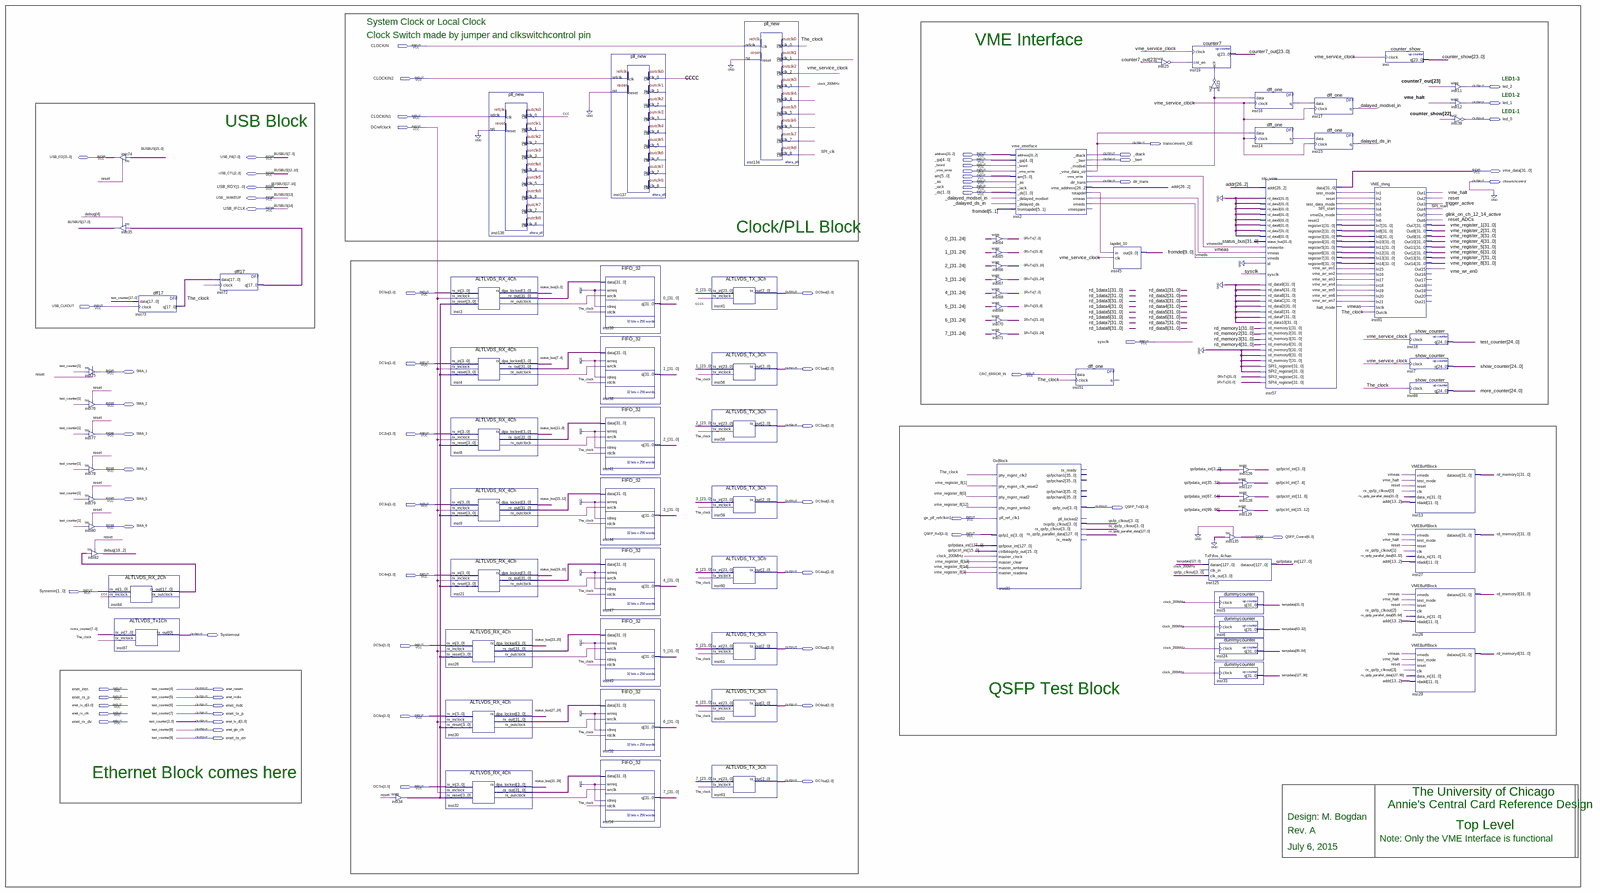
[diagram p0: schematic sheet, whole]
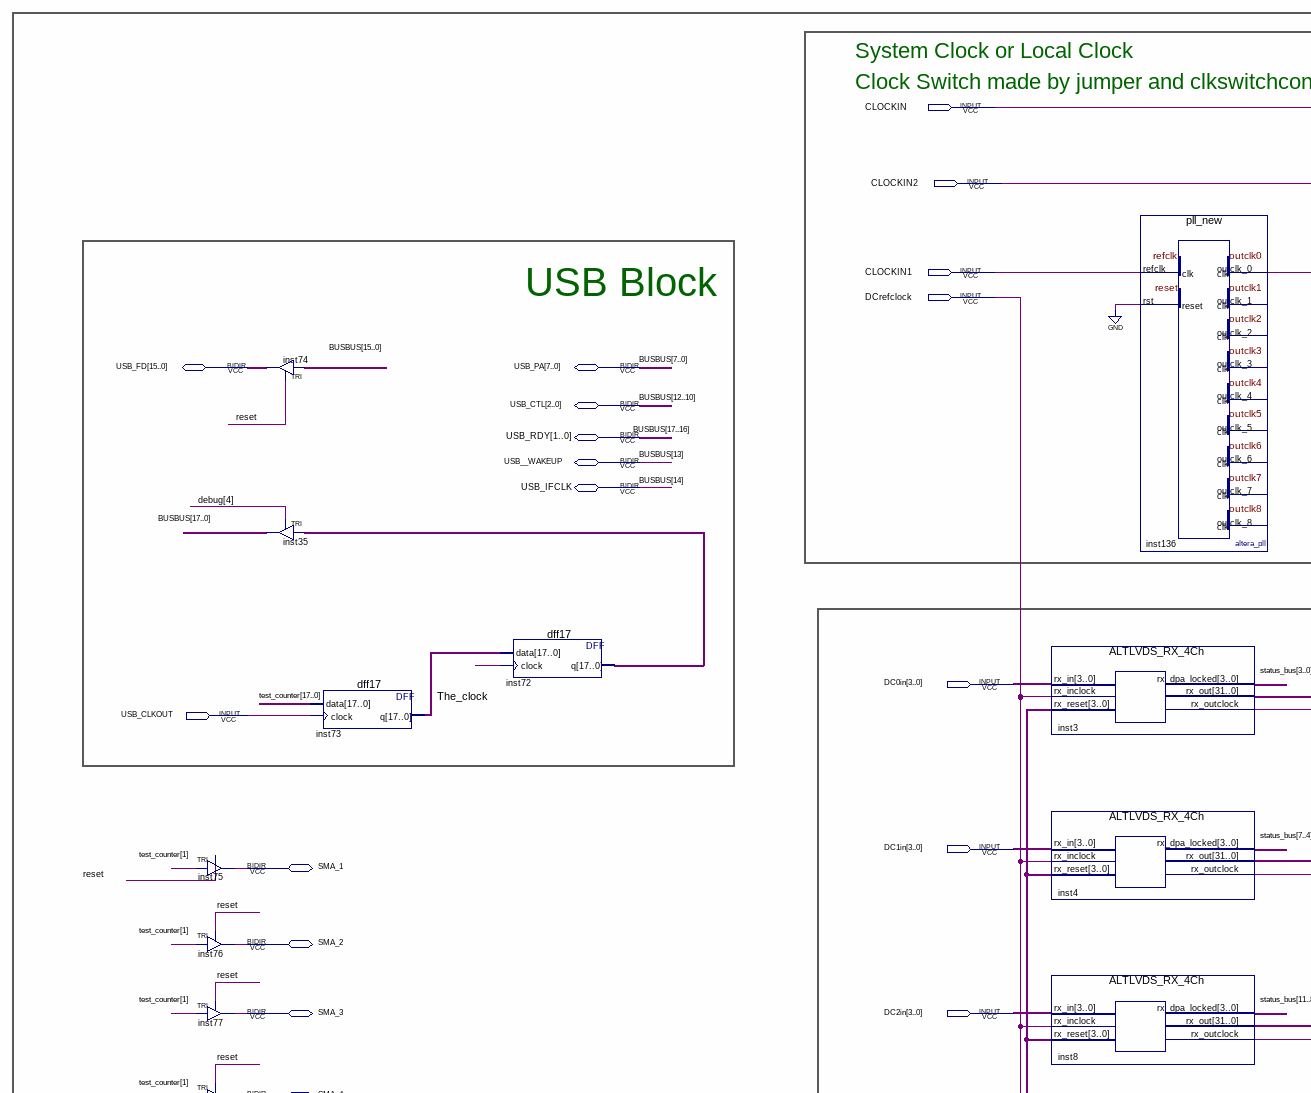
[diagram p1: schematic sheet, upper left part]
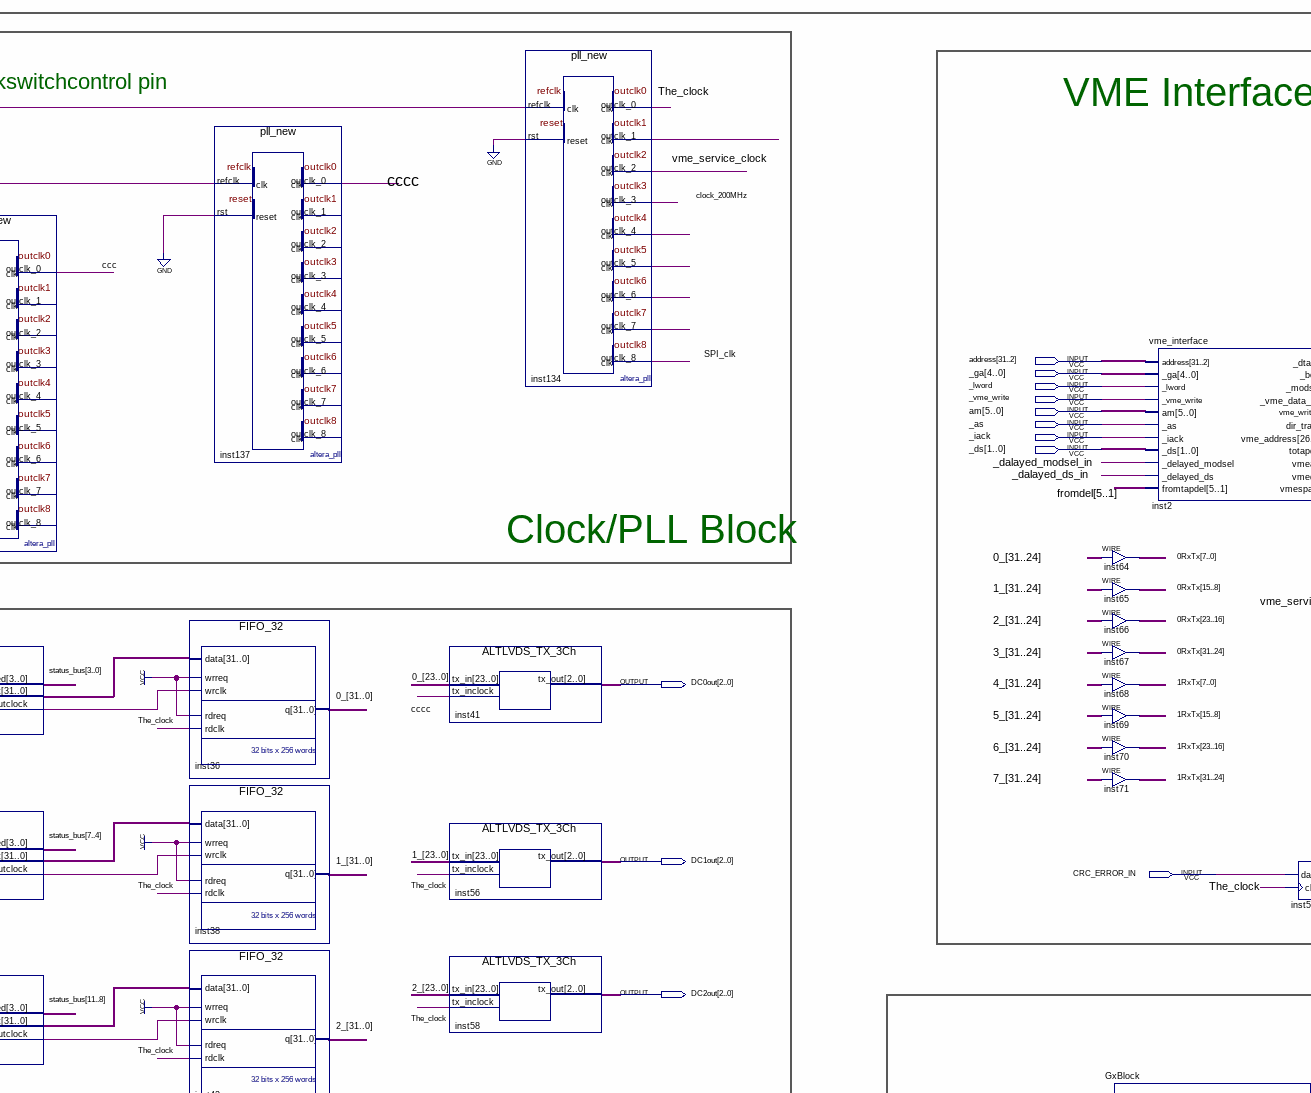
[diagram p2: schematic sheet, upper centre part]
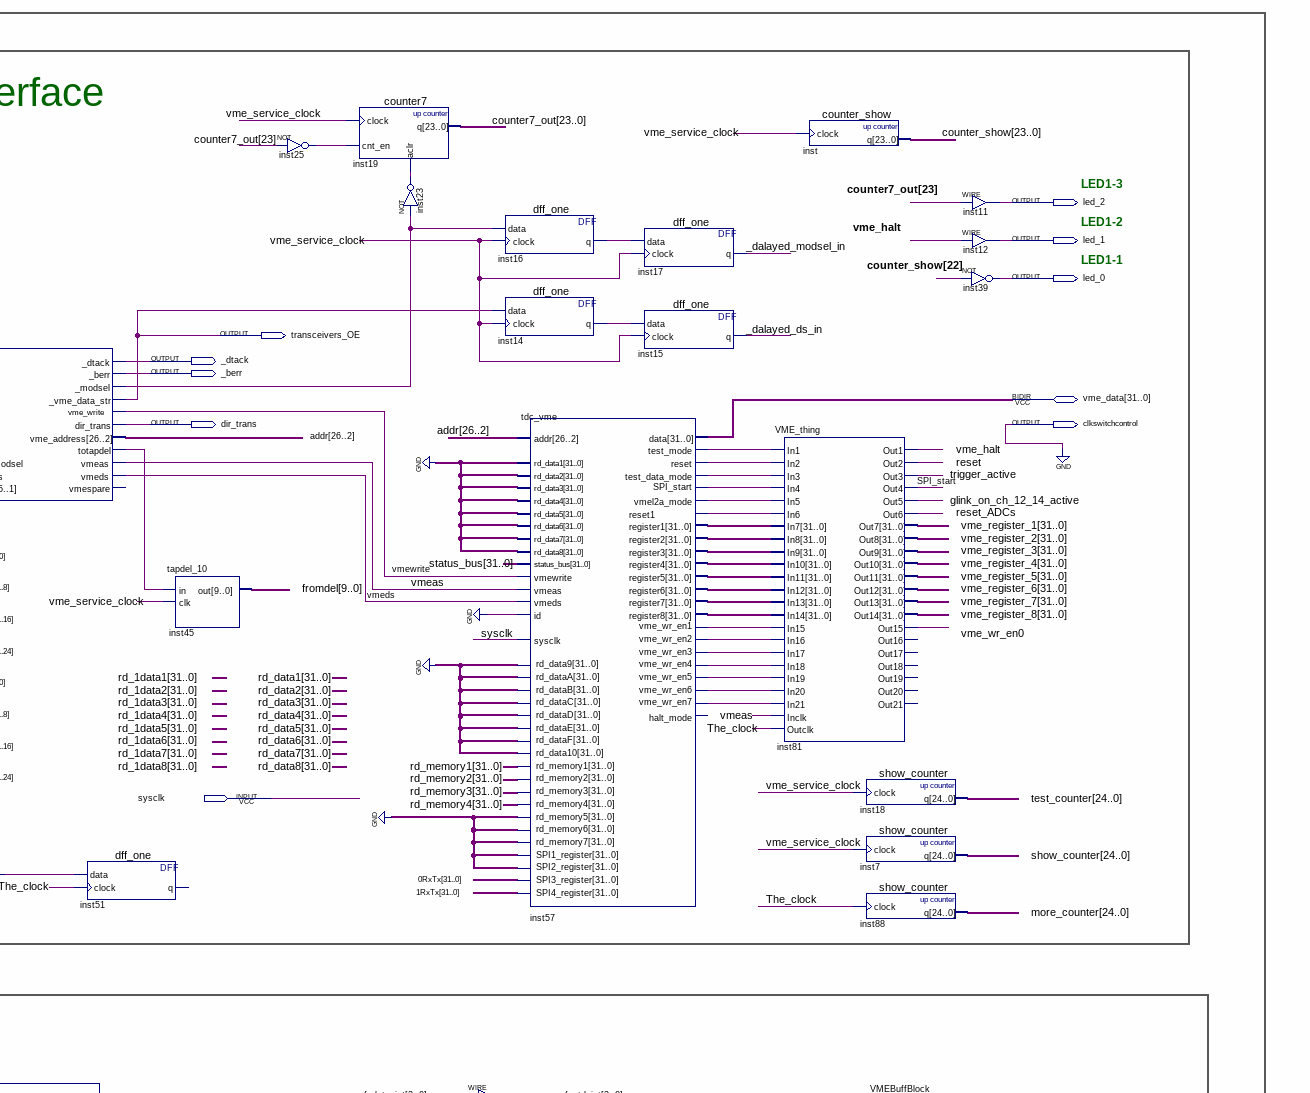
[diagram p3: schematic sheet, upper right part]
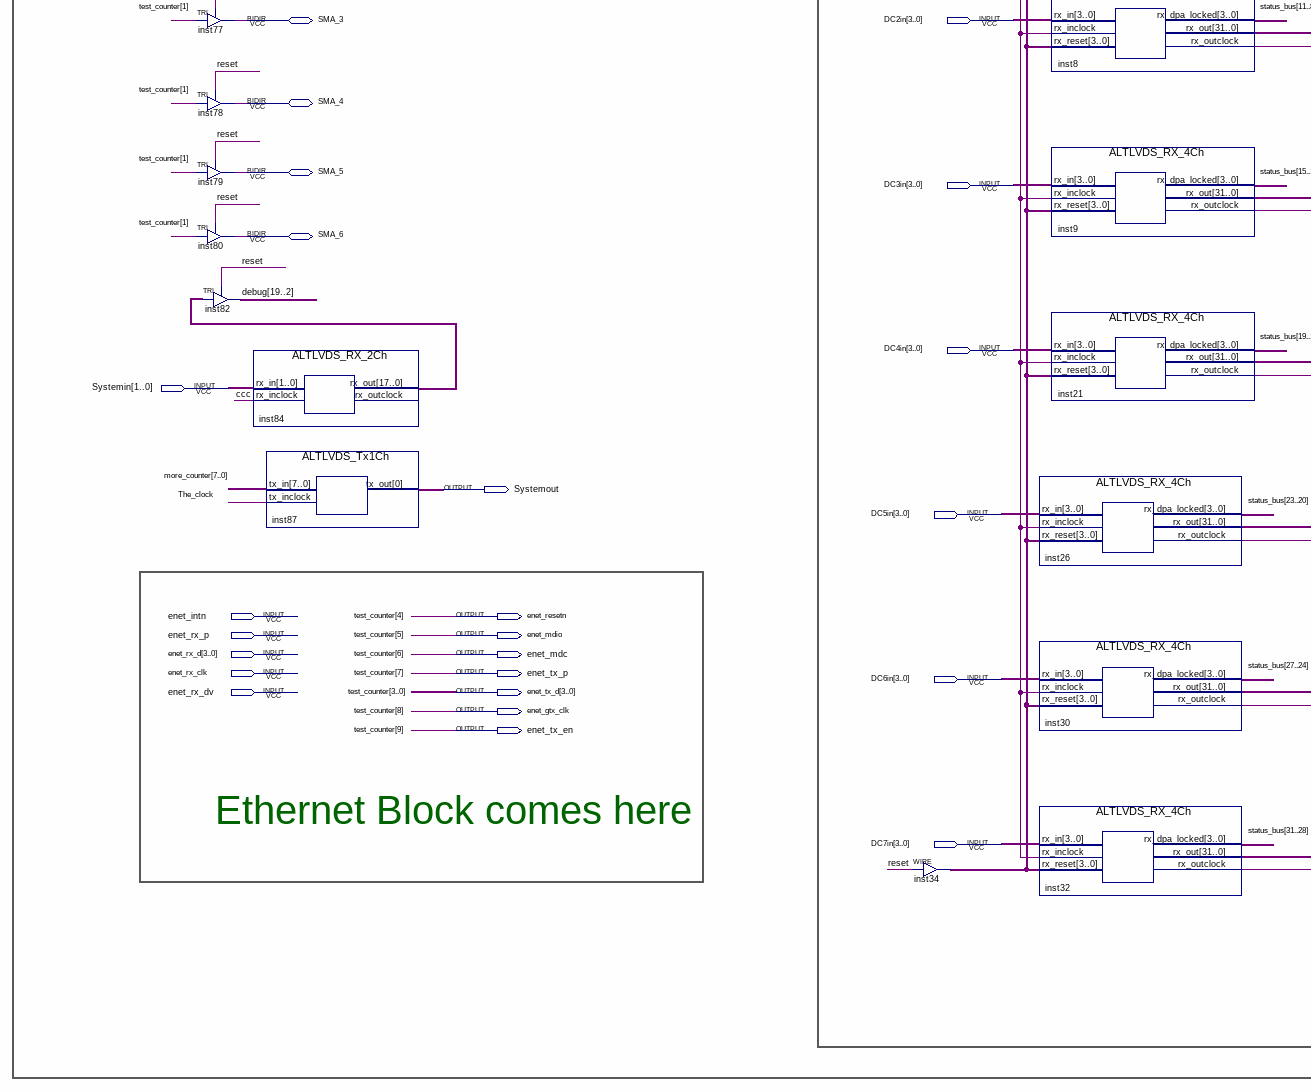
[diagram p4: schematic sheet, lower left part]
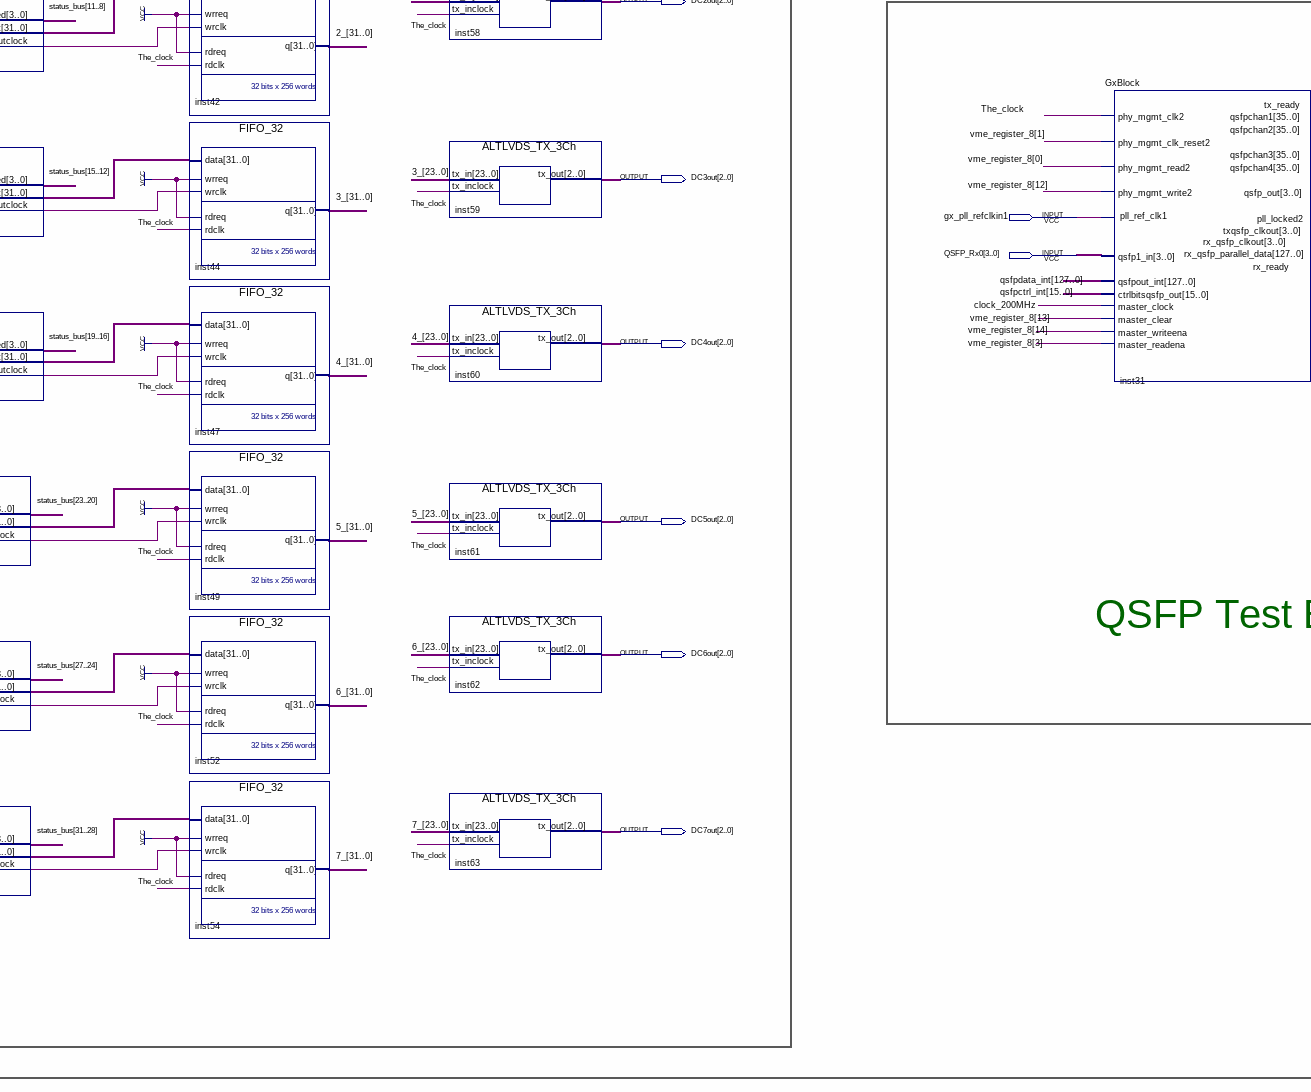
[diagram p5: schematic sheet, lower centre part]
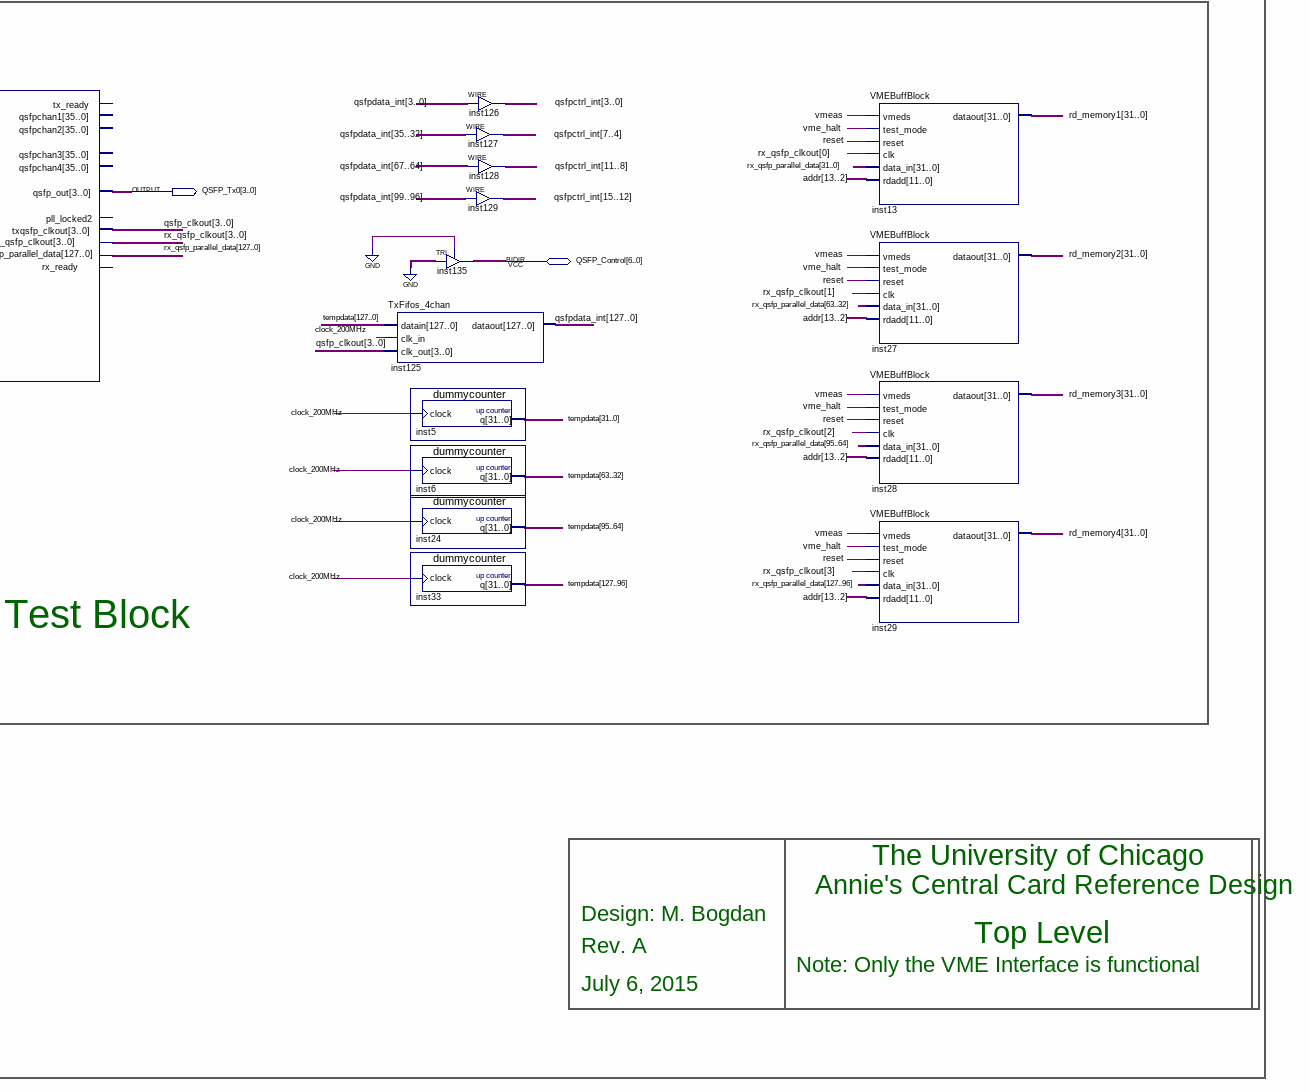
[diagram p6: schematic sheet, lower right part]
// Quartus schematic RxBack.bdf as structural Verilog: 83 symbols, 70 pins
module RxBack (
  input  CLOCKIN,
  input  CLOCKIN2,
  input  CLOCKIN1,
  input  DCrefclock,
  input  [31:2] address,
  input  [4:0] _ga,
  input  _lword,
  input  _vme_write,
  input  [5:0] am,
  input  _as,
  input  _iack,
  input  [1:0] _ds,
  input  [3:0] DC0in,
  input  USB_CLKOUT,
  input  sysclk,
  input  [3:0] DC1in,
  input  CRC_ERROR_IN,
  input  [3:0] DC2in,
  input  [3:0] DC3in,
  input  gx_pll_refclkin1,
  input  [3:0] QSFP_Rx0,
  input  [3:0] DC4in,
  input  [1:0] Systemin,
  input  [3:0] DC5in,
  input  enet_intn,
  input  enet_rx_p,
  input  [3:0] enet_rx_d,
  input  enet_rx_clk,
  input  [3:0] DC6in,
  input  enet_rx_dv,
  input  [3:0] DC7in,
  inout  [15:0] USB_FD,
  inout  [7:0] USB_PA,
  inout  [31:0] vme_data,
  inout  [2:0] USB_CTL,
  inout  [1:0] USB_RDY,
  inout  USB__WAKEUP,
  inout  USB_IFCLK,
  inout  SMA_1,
  inout  SMA_2,
  inout  SMA_3,
  inout  SMA_4,
  inout  SMA_5,
  inout  SMA_6,
  inout  [6:0] QSFP_Control,
  output led_2,
  output led_1,
  output led_0,
  output transceivers_OE,
  output _dtack,
  output _berr,
  output dir_trans,
  output clkswitchcontrol,
  output [2:0] DC0out,
  output [2:0] DC1out,
  output [2:0] DC2out,
  output [2:0] DC3out,
  output [3:0] QSFP_Tx0,
  output [2:0] DC4out,
  output Systemout,
  output [2:0] DC5out,
  output enet_resetn,
  output enet_mdio,
  output enet_mdc,
  output [2:0] DC6out,
  output enet_tx_p,
  output [3:0] enet_tx_d,
  output enet_gtx_clk,
  output enet_tx_en,
  output [2:0] DC7out
);

  wire _dalayed_ds_in, _dalayed_modsel_in, ccc, cccc, clock_200MHz, glink_on_ch_12_14_active, inst2__modsel,
       inst2_totapdel, inst3_rx_outclock, inst4_rx_outclock, inst8_rx_outclock, inst9_rx_outclock, inst14_q,
       inst16_q, inst21_rx_outclock, inst23_out, inst25_out, inst26_rx_outclock, inst30_rx_outclock,
       inst32_rx_outclock, inst57_reset, inst57_reset1, inst57_spi_start, inst57_test_data_mode,
       inst57_test_mode, inst57_vme_wr_en1, inst57_vme_wr_en2, inst57_vme_wr_en3, inst57_vme_wr_en4,
       inst57_vme_wr_en5, inst57_vme_wr_en6, inst57_vme_wr_en7, inst57_vmel2a_mode, inst134_outclk_1,
       inst134_outclk_4, inst134_outclk_5, inst134_outclk_6, inst134_outclk_7, reset, reset_ADCs, SPI_clk,
       SPI_start, The_clock, trigger_active, vme_halt, vme_service_clock, vme_wr_en0, vmeas, vmeds, vmewrite;
  wire [3:0] inst34_out, qsfp_clkout, rx_qsfp_clkout;
  wire [9:0] fromdel;
  wire [15:0] qsfpctrl_int;
  wire [15:8] BUSBUS;
  wire [17:0] inst72_q, inst73_q, inst84_rx_out;
  wire [19:2] debug;
  wire [23:0] counter7_out, counter_show;
  wire [24:0] more_counter, show_counter;
  wire [24:10] test_counter;
  wire [26:2] addr;
  wire [31:0] \0_ , \0RxTx , \1_ , \1RxTx , \2_ , \3_ , \4_ , \5_ , \6_ , \7_ , inst3_rx_out, inst4_rx_out,
       inst8_rx_out, inst9_rx_out, inst21_rx_out, inst26_rx_out, inst30_rx_out, inst32_rx_out,
       inst57_register1, inst57_register2, inst57_register3, inst57_register4, inst57_register5,
       inst57_register6, inst57_register7, inst57_register8, rd_memory1, rd_memory2, rd_memory3, rd_memory4,
       status_bus, vme_register_1, vme_register_2, vme_register_3, vme_register_4, vme_register_5,
       vme_register_6, vme_register_7, vme_register_8;
  wire [127:0] qsfpdata_int, rx_qsfp_parallel_data, tempdata;

  TRI inst75 (.IN(enet_tx_d[1]), .OE(reset), .OUT(SMA_1));
  TRI inst76 (.IN(enet_tx_d[1]), .OE(reset), .OUT(SMA_2));
  TRI inst77 (.IN(enet_tx_d[1]), .OE(reset), .OUT(SMA_3));
  TRI inst78 (.IN(enet_tx_d[1]), .OE(reset), .OUT(SMA_4));
  TRI inst79 (.IN(enet_tx_d[1]), .OE(reset), .OUT(SMA_5));
  TRI inst80 (.IN(enet_tx_d[1]), .OE(reset), .OUT(SMA_6));
  TRI inst82[17:0] (.IN(inst84_rx_out), .OE(reset), .OUT(debug));
  TRI inst74[15:0] (.IN({BUSBUS[15], USB_IFCLK, USB__WAKEUP, USB_CTL, BUSBUS[9:8], USB_PA}), .OE(reset), .OUT(USB_FD));
  TRI inst35[17:0] (
    .IN(inst72_q), .OE(debug[4]),
    .OUT({USB_RDY, BUSBUS[15], USB_IFCLK, USB__WAKEUP, USB_CTL, BUSBUS[9:8], USB_PA}));
  ALTLVDS_RX_2Ch inst84 (.rx_in(Systemin), .rx_inclock(ccc), .rx_out(inst84_rx_out));  // open: rx_outclock
  ALTLVDS_Tx1Ch inst87 (.tx_in(more_counter[7:0]), .tx_inclock(The_clock), .tx_out(Systemout));
  dff17 inst73 (
    .data({test_counter[17:10], enet_tx_en, enet_gtx_clk, enet_tx_p, enet_mdc, enet_mdio, enet_resetn, enet_tx_d}),
    .clock(USB_CLKOUT), .q(inst73_q));
  dff17 inst72 (.data(inst73_q), .clock(The_clock), .q(inst72_q));
  assign inst34_out = {4{reset}};  // WIRE inst34
  ALTLVDS_RX_4Ch inst3 (
    .rx_in(DC0in), .rx_inclock(DCrefclock), .rx_reset(inst34_out), .rx_dpa_locked(status_bus[3:0]),
    .rx_out(inst3_rx_out), .rx_outclock(inst3_rx_outclock));
  ALTLVDS_RX_4Ch inst4 (
    .rx_in(DC1in), .rx_inclock(DCrefclock), .rx_reset(inst34_out), .rx_dpa_locked(status_bus[7:4]),
    .rx_out(inst4_rx_out), .rx_outclock(inst4_rx_outclock));
  ALTLVDS_RX_4Ch inst8 (
    .rx_in(DC2in), .rx_inclock(DCrefclock), .rx_reset(inst34_out), .rx_dpa_locked(status_bus[11:8]),
    .rx_out(inst8_rx_out), .rx_outclock(inst8_rx_outclock));
  ALTLVDS_RX_4Ch inst9 (
    .rx_in(DC3in), .rx_inclock(DCrefclock), .rx_reset(inst34_out), .rx_dpa_locked(status_bus[15:12]),
    .rx_out(inst9_rx_out), .rx_outclock(inst9_rx_outclock));
  ALTLVDS_RX_4Ch inst21 (
    .rx_in(DC4in), .rx_inclock(DCrefclock), .rx_reset(inst34_out), .rx_dpa_locked(status_bus[19:16]),
    .rx_out(inst21_rx_out), .rx_outclock(inst21_rx_outclock));
  ALTLVDS_RX_4Ch inst26 (
    .rx_in(DC5in), .rx_inclock(DCrefclock), .rx_reset(inst34_out), .rx_dpa_locked(status_bus[23:20]),
    .rx_out(inst26_rx_out), .rx_outclock(inst26_rx_outclock));
  ALTLVDS_RX_4Ch inst30 (
    .rx_in(DC6in), .rx_inclock(DCrefclock), .rx_reset(inst34_out), .rx_dpa_locked(status_bus[27:24]),
    .rx_out(inst30_rx_out), .rx_outclock(inst30_rx_outclock));
  ALTLVDS_RX_4Ch inst32 (
    .rx_in(DC7in), .rx_inclock(DCrefclock), .rx_reset(inst34_out), .rx_dpa_locked(status_bus[31:28]),
    .rx_out(inst32_rx_out), .rx_outclock(inst32_rx_outclock));
  pll_new inst136 (
    .refclk(CLOCKIN1), .rst(1'b0), .outclk_0(ccc));  // open: outclk_1, outclk_2, outclk_3, outclk_4, outclk_5, outclk_6, outclk_7, outclk_8
  pll_new inst137 (
    .refclk(CLOCKIN2), .rst(1'b0), .outclk_0(cccc));  // open: outclk_1, outclk_2, outclk_3, outclk_4, outclk_5, outclk_6, outclk_7, outclk_8
  FIFO_32 inst36 (
    .data(inst3_rx_out), .wrreq(1'b1), .wrclk(inst3_rx_outclock), .rdreq(1'b1), .rdclk(The_clock), .q(\0_ ));
  FIFO_32 inst38 (
    .data(inst4_rx_out), .wrreq(1'b1), .wrclk(inst4_rx_outclock), .rdreq(1'b1), .rdclk(The_clock), .q(\1_ ));
  FIFO_32 inst42 (
    .data(inst8_rx_out), .wrreq(1'b1), .wrclk(inst8_rx_outclock), .rdreq(1'b1), .rdclk(The_clock), .q(\2_ ));
  FIFO_32 inst44 (
    .data(inst9_rx_out), .wrreq(1'b1), .wrclk(inst9_rx_outclock), .rdreq(1'b1), .rdclk(The_clock), .q(\3_ ));
  FIFO_32 inst47 (
    .data(inst21_rx_out), .wrreq(1'b1), .wrclk(inst21_rx_outclock), .rdreq(1'b1), .rdclk(The_clock), .q(\4_ ));
  FIFO_32 inst49 (
    .data(inst26_rx_out), .wrreq(1'b1), .wrclk(inst26_rx_outclock), .rdreq(1'b1), .rdclk(The_clock), .q(\5_ ));
  FIFO_32 inst52 (
    .data(inst30_rx_out), .wrreq(1'b1), .wrclk(inst30_rx_outclock), .rdreq(1'b1), .rdclk(The_clock), .q(\6_ ));
  FIFO_32 inst54 (
    .data(inst32_rx_out), .wrreq(1'b1), .wrclk(inst32_rx_outclock), .rdreq(1'b1), .rdclk(The_clock), .q(\7_ ));
  ALTLVDS_TX_3Ch inst41 (.tx_in(\0_ [23:0]), .tx_inclock(cccc), .tx_out(DC0out));
  ALTLVDS_TX_3Ch inst56 (.tx_in(\1_ [23:0]), .tx_inclock(The_clock), .tx_out(DC1out));
  ALTLVDS_TX_3Ch inst58 (.tx_in(\2_ [23:0]), .tx_inclock(The_clock), .tx_out(DC2out));
  ALTLVDS_TX_3Ch inst59 (.tx_in(\3_ [23:0]), .tx_inclock(The_clock), .tx_out(DC3out));
  ALTLVDS_TX_3Ch inst60 (.tx_in(\4_ [23:0]), .tx_inclock(The_clock), .tx_out(DC4out));
  ALTLVDS_TX_3Ch inst61 (.tx_in(\5_ [23:0]), .tx_inclock(The_clock), .tx_out(DC5out));
  ALTLVDS_TX_3Ch inst62 (.tx_in(\6_ [23:0]), .tx_inclock(The_clock), .tx_out(DC6out));
  ALTLVDS_TX_3Ch inst63 (.tx_in(\7_ [23:0]), .tx_inclock(The_clock), .tx_out(DC7out));
  pll_new inst134 (
    .refclk(CLOCKIN), .rst(1'b0), .outclk_0(The_clock), .outclk_1(inst134_outclk_1),
    .outclk_2(vme_service_clock), .outclk_3(clock_200MHz), .outclk_4(inst134_outclk_4),
    .outclk_5(inst134_outclk_5), .outclk_6(inst134_outclk_6), .outclk_7(inst134_outclk_7), .outclk_8(SPI_clk));
  assign \0RxTx [7:0] = \0_ [31:24];  // WIRE inst64
  assign \0RxTx [15:8] = \1_ [31:24];  // WIRE inst65
  assign \0RxTx [23:16] = \2_ [31:24];  // WIRE inst66
  assign \0RxTx [31:24] = \3_ [31:24];  // WIRE inst67
  assign \1RxTx [7:0] = \4_ [31:24];  // WIRE inst68
  assign \1RxTx [15:8] = \5_ [31:24];  // WIRE inst69
  assign \1RxTx [23:16] = \6_ [31:24];  // WIRE inst70
  assign \1RxTx [31:24] = \7_ [31:24];  // WIRE inst71
  GxBlock inst31 (
    .phy_mgmt_clk2(The_clock), .phy_mgmt_clk_reset2(vme_register_8[1]), .phy_mgmt_read2(vme_register_8[0]),
    .phy_mgmt_write2(vme_register_8[12]), .qsfp1_in(QSFP_Rx0), .qsfpout_int(qsfpdata_int),
    .ctrlbitsqsfp_out(qsfpctrl_int), .master_clock(clock_200MHz), .master_clear(vme_register_8[13]),
    .master_writeena(vme_register_8[14]), .master_readena(vme_register_8[3]),
    .pll_ref_clk1(gx_pll_refclkin1), .qsfp_out(QSFP_Tx0), .txqsfp_clkout(qsfp_clkout),
    .rx_qsfp_parallel_data(rx_qsfp_parallel_data), .rx_qsfp_clkout(rx_qsfp_clkout));  // open: qsfpchan1, qsfpchan2, qsfpchan3, qsfpchan4, pll_locked2, tx_ready, rx_ready
  vme_interface inst2 (
    .address(address), ._ga(_ga), ._lword(_lword), ._vme_write(_vme_write), .am(am), ._as(_as),
    ._iack(_iack), ._ds(_ds), ._delayed_modsel(_dalayed_modsel_in), ._delayed_ds(_dalayed_ds_in),
    .fromtapdel(fromdel[5:1]), ._modsel(inst2__modsel), ._vme_data_str(transceivers_OE),
    .vme_write(vmewrite), .dir_trans(dir_trans), .vme_address(addr), .totapdel(inst2_totapdel),
    .vmeas(vmeas), .vmeds(vmeds), ._dtack(_dtack), ._berr(_berr));  // open: vmespare
  dff_one inst51 (.data(CRC_ERROR_IN), .clock(The_clock));  // open: q
  tapdel_10 inst45 (.in(inst2_totapdel), .clk(vme_service_clock), .out(fromdel));
  not inst25 (inst25_out, counter7_out[23]);
  counter7 inst19 (.clock(vme_service_clock), .cnt_en(inst25_out), .aclr(inst23_out), .q(counter7_out));
  TxFifos_4chan inst125 (.datain(tempdata), .clk_in(clock_200MHz), .clk_out(qsfp_clkout), .dataout(qsfpdata_int));
  not inst23 (inst23_out, inst2__modsel);
  TRI inst135[6:0] (.IN({7{1'b0}}), .OE(1'b0), .OUT(QSFP_Control));
  dummycounter inst5 (.clock(clock_200MHz), .q(tempdata[31:0]));
  dummycounter inst6 (.clock(clock_200MHz), .q(tempdata[63:32]));
  dummycounter inst24 (.clock(clock_200MHz), .q(tempdata[95:64]));
  dummycounter inst33 (.clock(clock_200MHz), .q(tempdata[127:96]));
  assign qsfpctrl_int[3:0] = qsfpdata_int[3:0];  // WIRE inst126
  assign qsfpctrl_int[7:4] = qsfpdata_int[35:32];  // WIRE inst127
  assign qsfpctrl_int[11:8] = qsfpdata_int[67:64];  // WIRE inst128
  assign qsfpctrl_int[15:12] = qsfpdata_int[99:96];  // WIRE inst129
  dff_one inst16 (.data(inst2__modsel), .clock(vme_service_clock), .q(inst16_q));
  dff_one inst14 (.data(transceivers_OE), .clock(vme_service_clock), .q(inst14_q));
  tdc_vme inst57 (
    .addr(addr), .rd_data1({32{1'b0}}), .rd_data2({32{1'b0}}), .rd_data3({32{1'b0}}), .rd_data4({32{1'b0}}),
    .rd_data5({32{1'b0}}), .rd_data6({32{1'b0}}), .rd_data7({32{1'b0}}), .rd_data8({32{1'b0}}),
    .status_bus(status_bus), .vmewrite(vmewrite), .vmeas(vmeas), .vmeds(vmeds), .id(1'b0), .sysclk(sysclk),
    .rd_dataA({32{1'b0}}), .rd_dataB({32{1'b0}}), .rd_dataC({32{1'b0}}), .rd_dataD({32{1'b0}}),
    .rd_dataF({32{1'b0}}), .rd_data10({32{1'b0}}), .rd_data9({32{1'b0}}), .rd_dataE({32{1'b0}}),
    .rd_memory1(rd_memory1), .rd_memory2(rd_memory2), .rd_memory3(rd_memory3), .rd_memory4(rd_memory4),
    .rd_memory5({32{1'b0}}), .rd_memory6({32{1'b0}}), .rd_memory7({32{1'b0}}), .SPI1_register({32{1'b0}}),
    .SPI2_register({32{1'b0}}), .SPI3_register(\0RxTx ), .SPI4_register(\1RxTx ),
    .test_mode(inst57_test_mode), .reset(inst57_reset), .test_data_mode(inst57_test_data_mode),
    .vmel2a_mode(inst57_vmel2a_mode), .register1(inst57_register1), .register2(inst57_register2),
    .register3(inst57_register3), .register4(inst57_register4), .register5(inst57_register5),
    .register6(inst57_register6), .register7(inst57_register7), .register8(inst57_register8),
    .reset1(inst57_reset1), .vme_wr_en1(inst57_vme_wr_en1), .vme_wr_en2(inst57_vme_wr_en2),
    .vme_wr_en3(inst57_vme_wr_en3), .vme_wr_en4(inst57_vme_wr_en4), .vme_wr_en5(inst57_vme_wr_en5),
    .vme_wr_en6(inst57_vme_wr_en6), .vme_wr_en7(inst57_vme_wr_en7), .SPI_start(inst57_spi_start),
    .data(vme_data));  // open: halt_mode
  dff_one inst17 (.data(inst16_q), .clock(vme_service_clock), .q(_dalayed_modsel_in));
  dff_one inst15 (.data(inst14_q), .clock(vme_service_clock), .q(_dalayed_ds_in));
  VME_thing inst81 (
    .In1(inst57_test_mode), .In2(inst57_reset), .In3(inst57_test_data_mode), .In4(inst57_spi_start),
    .In5(inst57_vmel2a_mode), .In6(inst57_reset1), .In7(inst57_register1), .In8(inst57_register2),
    .In9(inst57_register3), .In10(inst57_register4), .In11(inst57_register5), .In12(inst57_register6),
    .In13(inst57_register7), .In14(inst57_register8), .In15(inst57_vme_wr_en1), .In16(inst57_vme_wr_en2),
    .In17(inst57_vme_wr_en3), .In18(inst57_vme_wr_en4), .In19(inst57_vme_wr_en5), .In20(inst57_vme_wr_en6),
    .In21(inst57_vme_wr_en7), .Inclk(vmeas), .Outclk(The_clock), .Out1(vme_halt), .Out2(reset),
    .Out3(trigger_active), .Out4(SPI_start), .Out5(glink_on_ch_12_14_active), .Out6(reset_ADCs),
    .Out7(vme_register_1), .Out8(vme_register_2), .Out9(vme_register_3), .Out10(vme_register_4),
    .Out11(vme_register_5), .Out12(vme_register_6), .Out13(vme_register_7), .Out14(vme_register_8),
    .Out15(vme_wr_en0));  // open: Out16, Out17, Out18, Out19, Out20, Out21
  counter_show inst (.clock(vme_service_clock), .q(counter_show));
  show_counter inst18 (
    .clock(vme_service_clock),
    .q({test_counter, enet_tx_en, enet_gtx_clk, enet_tx_p, enet_mdc, enet_mdio, enet_resetn, enet_tx_d}));
  show_counter inst7 (.clock(vme_service_clock), .q(show_counter));
  show_counter inst88 (.clock(The_clock), .q(more_counter));
  VMEBuffBlock inst13 (
    .vmeds(vmeas), .test_mode(vme_halt), .reset(reset), .clk(rx_qsfp_clkout[0]),
    .data_in(rx_qsfp_parallel_data[31:0]), .rdadd(addr[13:2]), .dataout(rd_memory1));
  VMEBuffBlock inst27 (
    .vmeds(vmeas), .test_mode(vme_halt), .reset(reset), .clk(rx_qsfp_clkout[1]),
    .data_in(rx_qsfp_parallel_data[63:32]), .rdadd(addr[13:2]), .dataout(rd_memory2));
  VMEBuffBlock inst28 (
    .vmeds(vmeas), .test_mode(vme_halt), .reset(reset), .clk(rx_qsfp_clkout[2]),
    .data_in(rx_qsfp_parallel_data[95:64]), .rdadd(addr[13:2]), .dataout(rd_memory3));
  VMEBuffBlock inst29 (
    .vmeds(vmeas), .test_mode(vme_halt), .reset(reset), .clk(rx_qsfp_clkout[3]),
    .data_in(rx_qsfp_parallel_data[127:96]), .rdadd(addr[13:2]), .dataout(rd_memory4));
  assign led_2 = counter7_out[23];  // WIRE inst11
  assign led_1 = vme_halt;  // WIRE inst12
  not inst39 (led_0, counter_show[22]);

  assign clkswitchcontrol = 1'b0;

  // Other names for the same wires on the sheet: BUSBUS (some bits) = {USB_RDY, USB_IFCLK, USB__WAKEUP, USB_CTL, USB_PA};
  //   test_counter[9:0] = {enet_tx_en, enet_gtx_clk, enet_tx_p, enet_mdc, enet_mdio, enet_resetn, enet_tx_d}

  // Notes on the sheet:
  //   System Clock or Local Clock
  //   Clock Switch made by jumper and clkswitchcontrol pin
  //   VME Interface
  //   LED1-3
  //   LED1-2
  //   LED1-1
  //   USB Block
  //   Clock/PLL Block
  //   QSFP Test Block
  //   Ethernet Block comes here
  //   The University of Chicago
  //   Annie's Central Card Reference Design
  //   Design: M. Bogdan
  //   Top Level
  //   Rev. A
  //   Note: Only the VME Interface is functional
  //   July 6, 2015
endmodule
